# EasyEDA schematic AC_controller_2020-08-26_13-25-38.json
TITLE: AC Controller; REV: 1.0; Date: 2020-08-24; Sheet: 1/1; Drawn By: ctv; Company: HomePlace
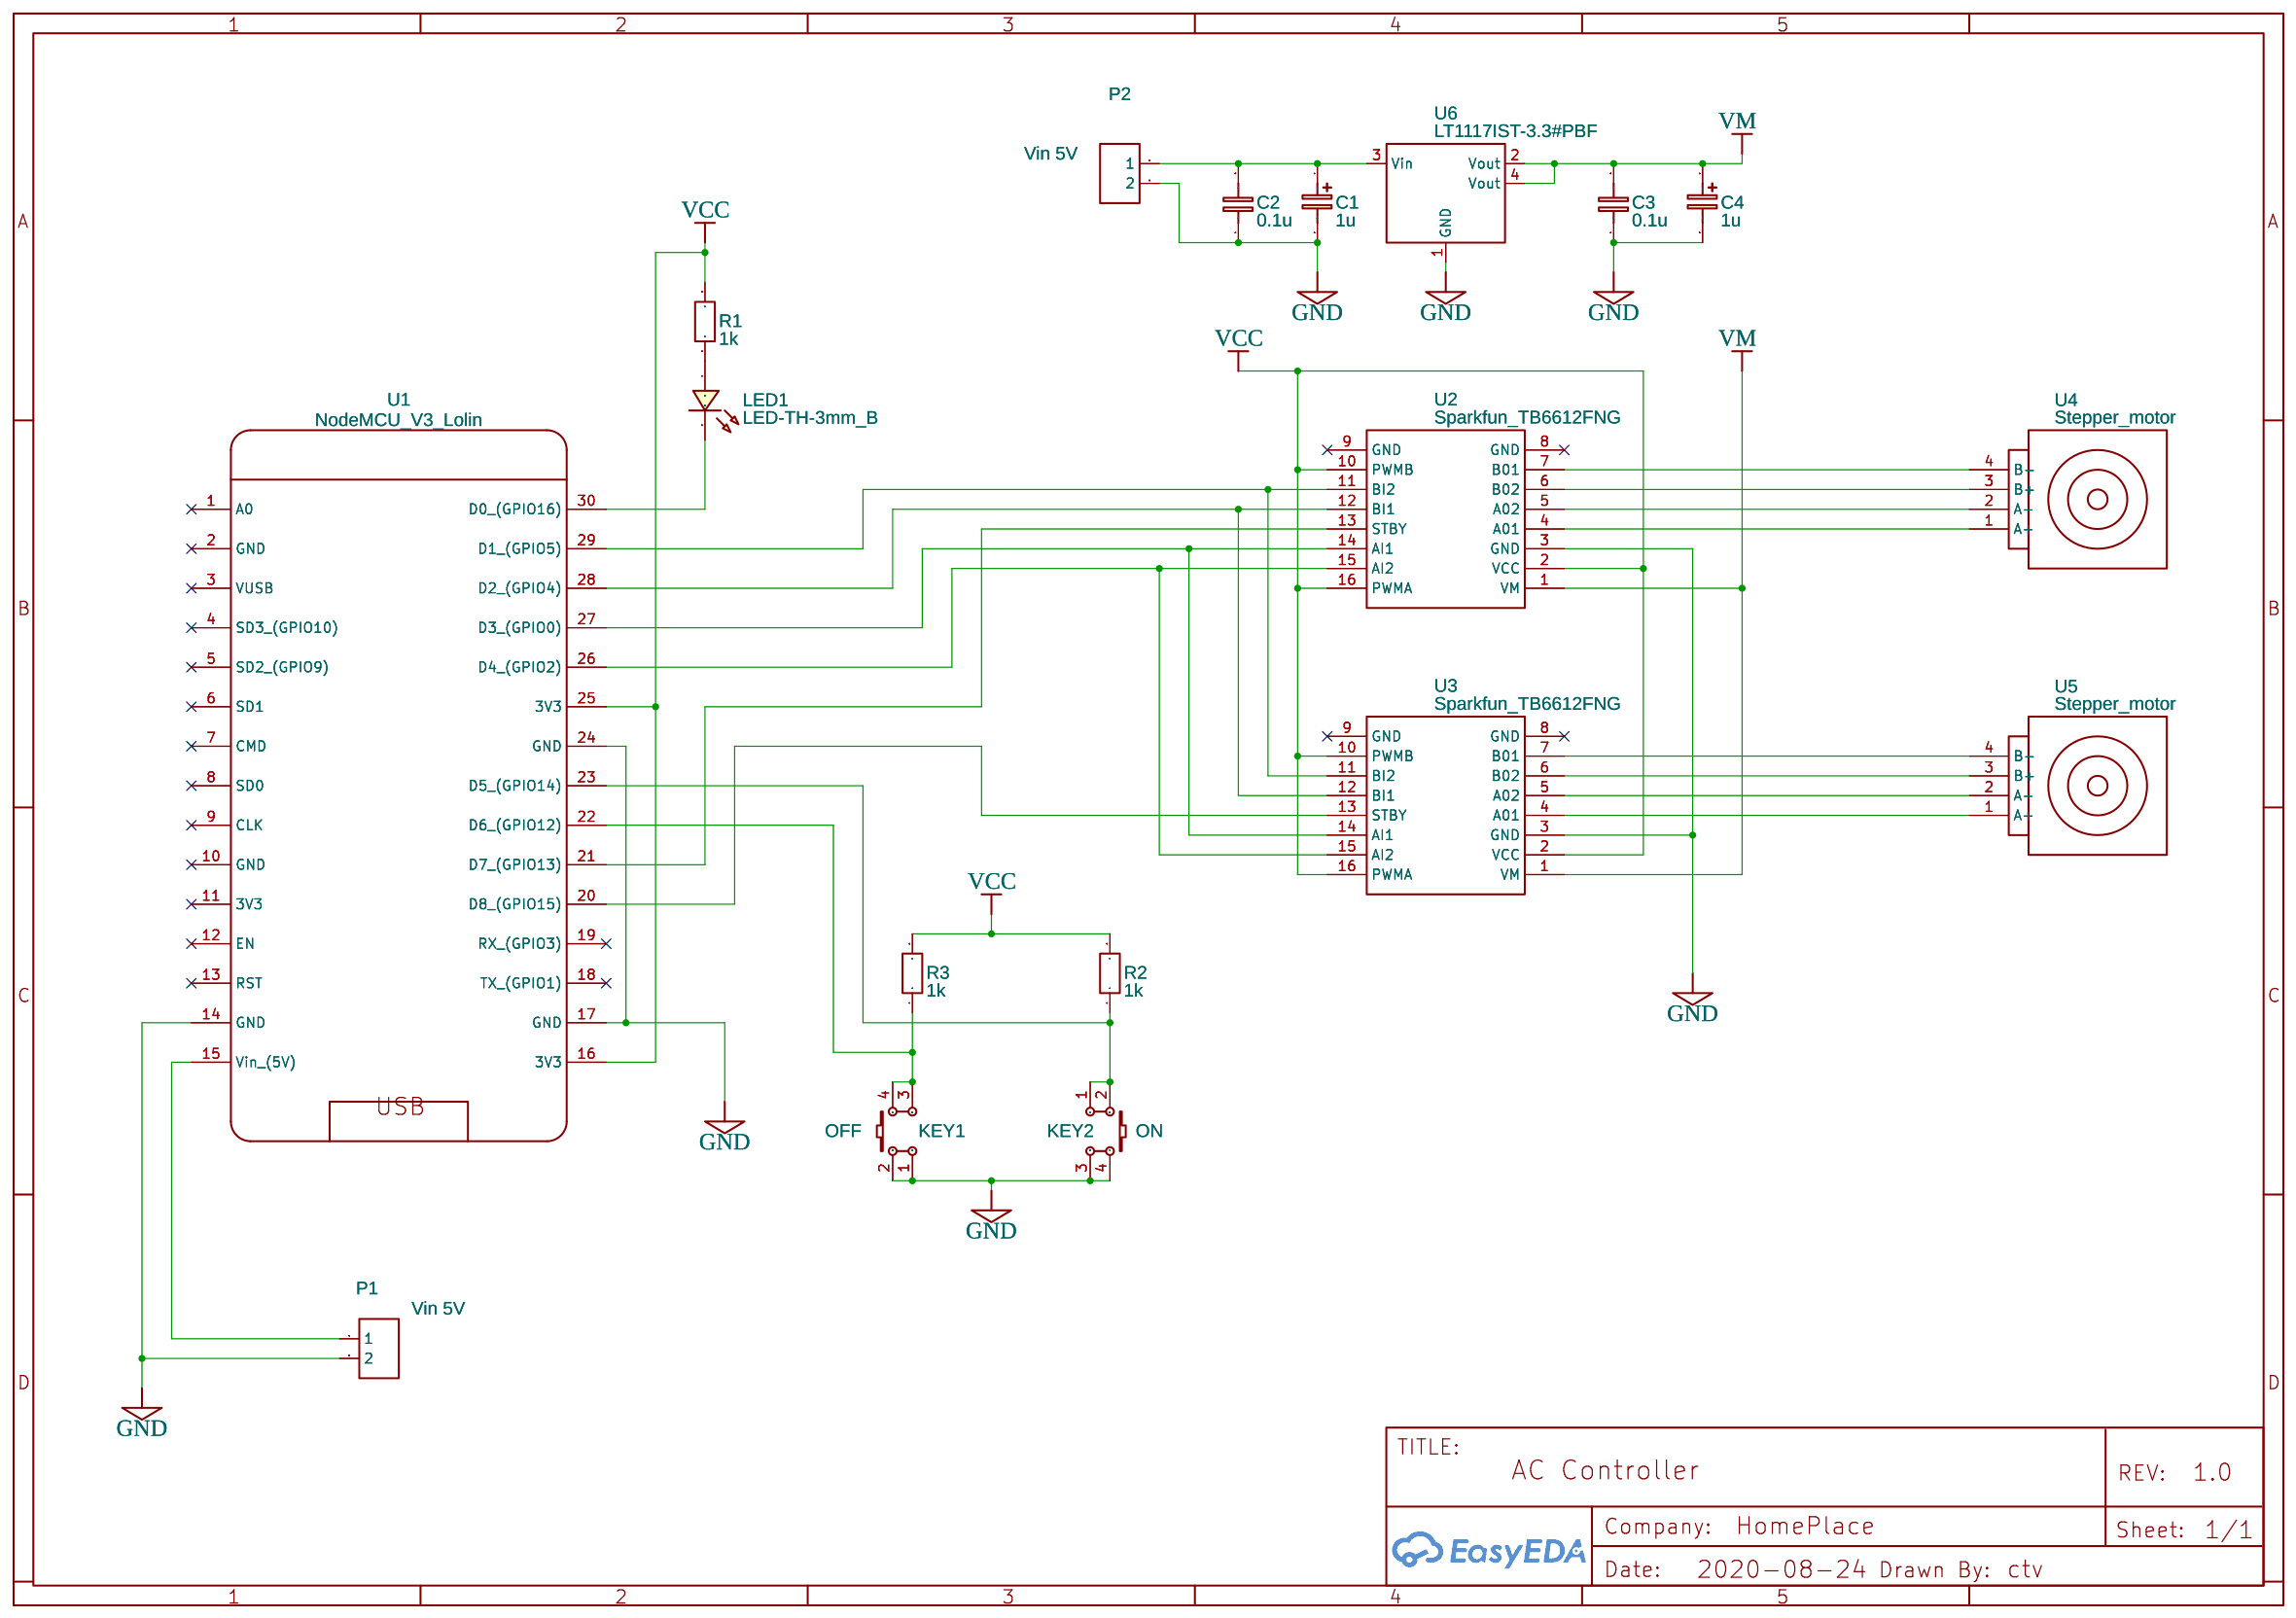
[diagram p0: schematic sheet]

## Parts
C1  1u  [CASE-A_3216]
C2  0.1u  [C0603]
C3  0.1u  [C0603]
C4  1u  [CASE-A_3216]
KEY1  OFF  [KEY-TH_4P-L12.0-W12.0-P5.00-LS12.5]
KEY2  ON  [KEY-TH_4P-L12.0-W12.0-P5.00-LS12.5]
LED1  LED-TH-3mm_B  [LED-TH_BD3.0_BLUE]
P1  Vin 5V  [CONN-TH_2P-P5.08]
P2  Vin 5V  [CONN-TH_2P-P5.08]
R1  1k  [R0603]
R2  1k  [R0603]
R3  1k  [R0603]
U1  NodeMCU_V3_Lolin  [NEW PCB NODEMCUV3]
U2  Sparkfun_TB6612FNG  [SPARKFUN_TB6612FNG]
U3  Sparkfun_TB6612FNG  [SPARKFUN_TB6612FNG]
U4  Stepper_motor  [CONN-TH_4P_XHB-4A]
U5  Stepper_motor  [CONN-TH_4P_XHB-4A]
U6  LT1117IST-3.3#PBF  [SOT-223_L6.5-W3.5-P2.30-LS7.0-BR]

## Library data of the parts
C1 C4 = C_Tan_SMD_A_EU: Contributor: LCEDA_Lib
C2 C3 = C_0603_EU: Contributor: LCEDA_Lib
KEY1 KEY2 = K4-12×12_TH: Supplier Part: C128053; Supplier: LCSC; Manufacturer: 韩国韩荣; Manufacturer Part: K2-1103DP-M4SW-04; Contributor: LCEDA_Lib
LED1 = LED-TH-3mm_B: Manufacturer: EVERLIGHT(台湾亿光); Manufacturer Part: 204-10SUBC/S400-A4; Supplier Part: C86881; Supplier: LCSC; Contributor: LCEDA_Lib
P1 P2 = CONN-TH_2P-P5.08: Supplier: LCSC; Contributor: LCEDA_Lib
R1-R3 = R_0603_EU: Contributor: LCEDA_Lib
U1 = NodeMCU_ESP8266-12E_Lolin: Manufacturer Part: NodeMCU ESP8266-12E Amica V2; Contributor: HL2OWX
U2 U3 = Sparkfun_TB6612FNG: Contributor: bliviudaniel
U4 U5 = Stepper_motor: Manufacturer Part: NEMA 23 Stepper Motor; Contributor: drift developers
U6 = LT1117IST-3.3#PBF: Supplier: LCSC; Manufacturer: LINEAR; Supplier Part: C114908

## Nets
GND: C1.2 C2.1 C3.1 C4.2 KEY1.1 KEY1.2 KEY2.3 KEY2.4 P1.2 P2.2 U1.14(GND) U1.17(GND) U1.24(GND) U2.3(GND) U3.3(GND) U6.1(GND)
VCC: R1.2 R2.2 R3.2 U1.16(3V3) U1.25(3V3) U2.2(VCC) U2.10(PWMB) U2.16(PWMA) U3.2(VCC) U3.10(PWMB) U3.16(PWMA)
VM: C3.2 C4.1 U2.1(VM) U3.1(VM) U6.2(Vout) U6.4(Vout)
Net-(C1-1): C1.1 C2.2 P2.1 U6.3(Vin)
Net-(KEY1-3): KEY1.3 KEY1.4 R3.1 U1.22(D6 (GPIO12))
Net-(KEY2-1): KEY2.1 KEY2.2 R2.1 U1.23(D5 (GPIO14))
Net-(LED1-1): LED1.1 R1.1
Net-(LED1-2): LED1.2 U1.30(D0 (GPIO16))
Net-(P1-1): P1.1 U1.15(Vin (5V))
Net-(U1-20): U1.20(D8 (GPIO15)) U3.13(STBY)
Net-(U1-21): U1.21(D7 (GPIO13)) U2.13(STBY)
Net-(U1-26): U1.26(D4 (GPIO2)) U2.15(AI2) U3.15(AI2)
Net-(U1-27): U1.27(D3 (GPIO0)) U2.14(AI1) U3.14(AI1)
Net-(U1-28): U1.28(D2 (GPIO4)) U2.12(BI1) U3.12(BI1)
Net-(U1-29): U1.29(D1 (GPIO5)) U2.11(BI2) U3.11(BI2)
Net-(U2-4): U2.4(A01) U4.1(A+)
Net-(U2-5): U2.5(A02) U4.2(A-)
Net-(U2-6): U2.6(B02) U4.3(B+)
Net-(U2-7): U2.7(B01) U4.4(B-)
Net-(U3-4): U3.4(A01) U5.1(A+)
Net-(U3-5): U3.5(A02) U5.2(A-)
Net-(U3-6): U3.6(B02) U5.3(B+)
Net-(U3-7): U3.7(B01) U5.4(B-)

Not connected (* = marked no-connect by the designer): U1 1(A0)* 2(GND)* 3(VUSB)* 4(SD3 (GPIO10))* 5(SD2 (GPIO9))* 6(SD1)* 7(CMD)* 8(SD0)* 9(CLK)* 10(GND)* 11(3V3)* 12(EN)* 13(RST)* 18(TX (GPIO1))* 19(RX (GPIO3))*; U2 8(GND)* 9(GND)*; U3 8(GND)* 9(GND)*
